# Altium schematic sheet 23_IMU_GPS.SchDoc (part 1 of 2)
size A3; SheetNumber: 24; SheetTotal: 24
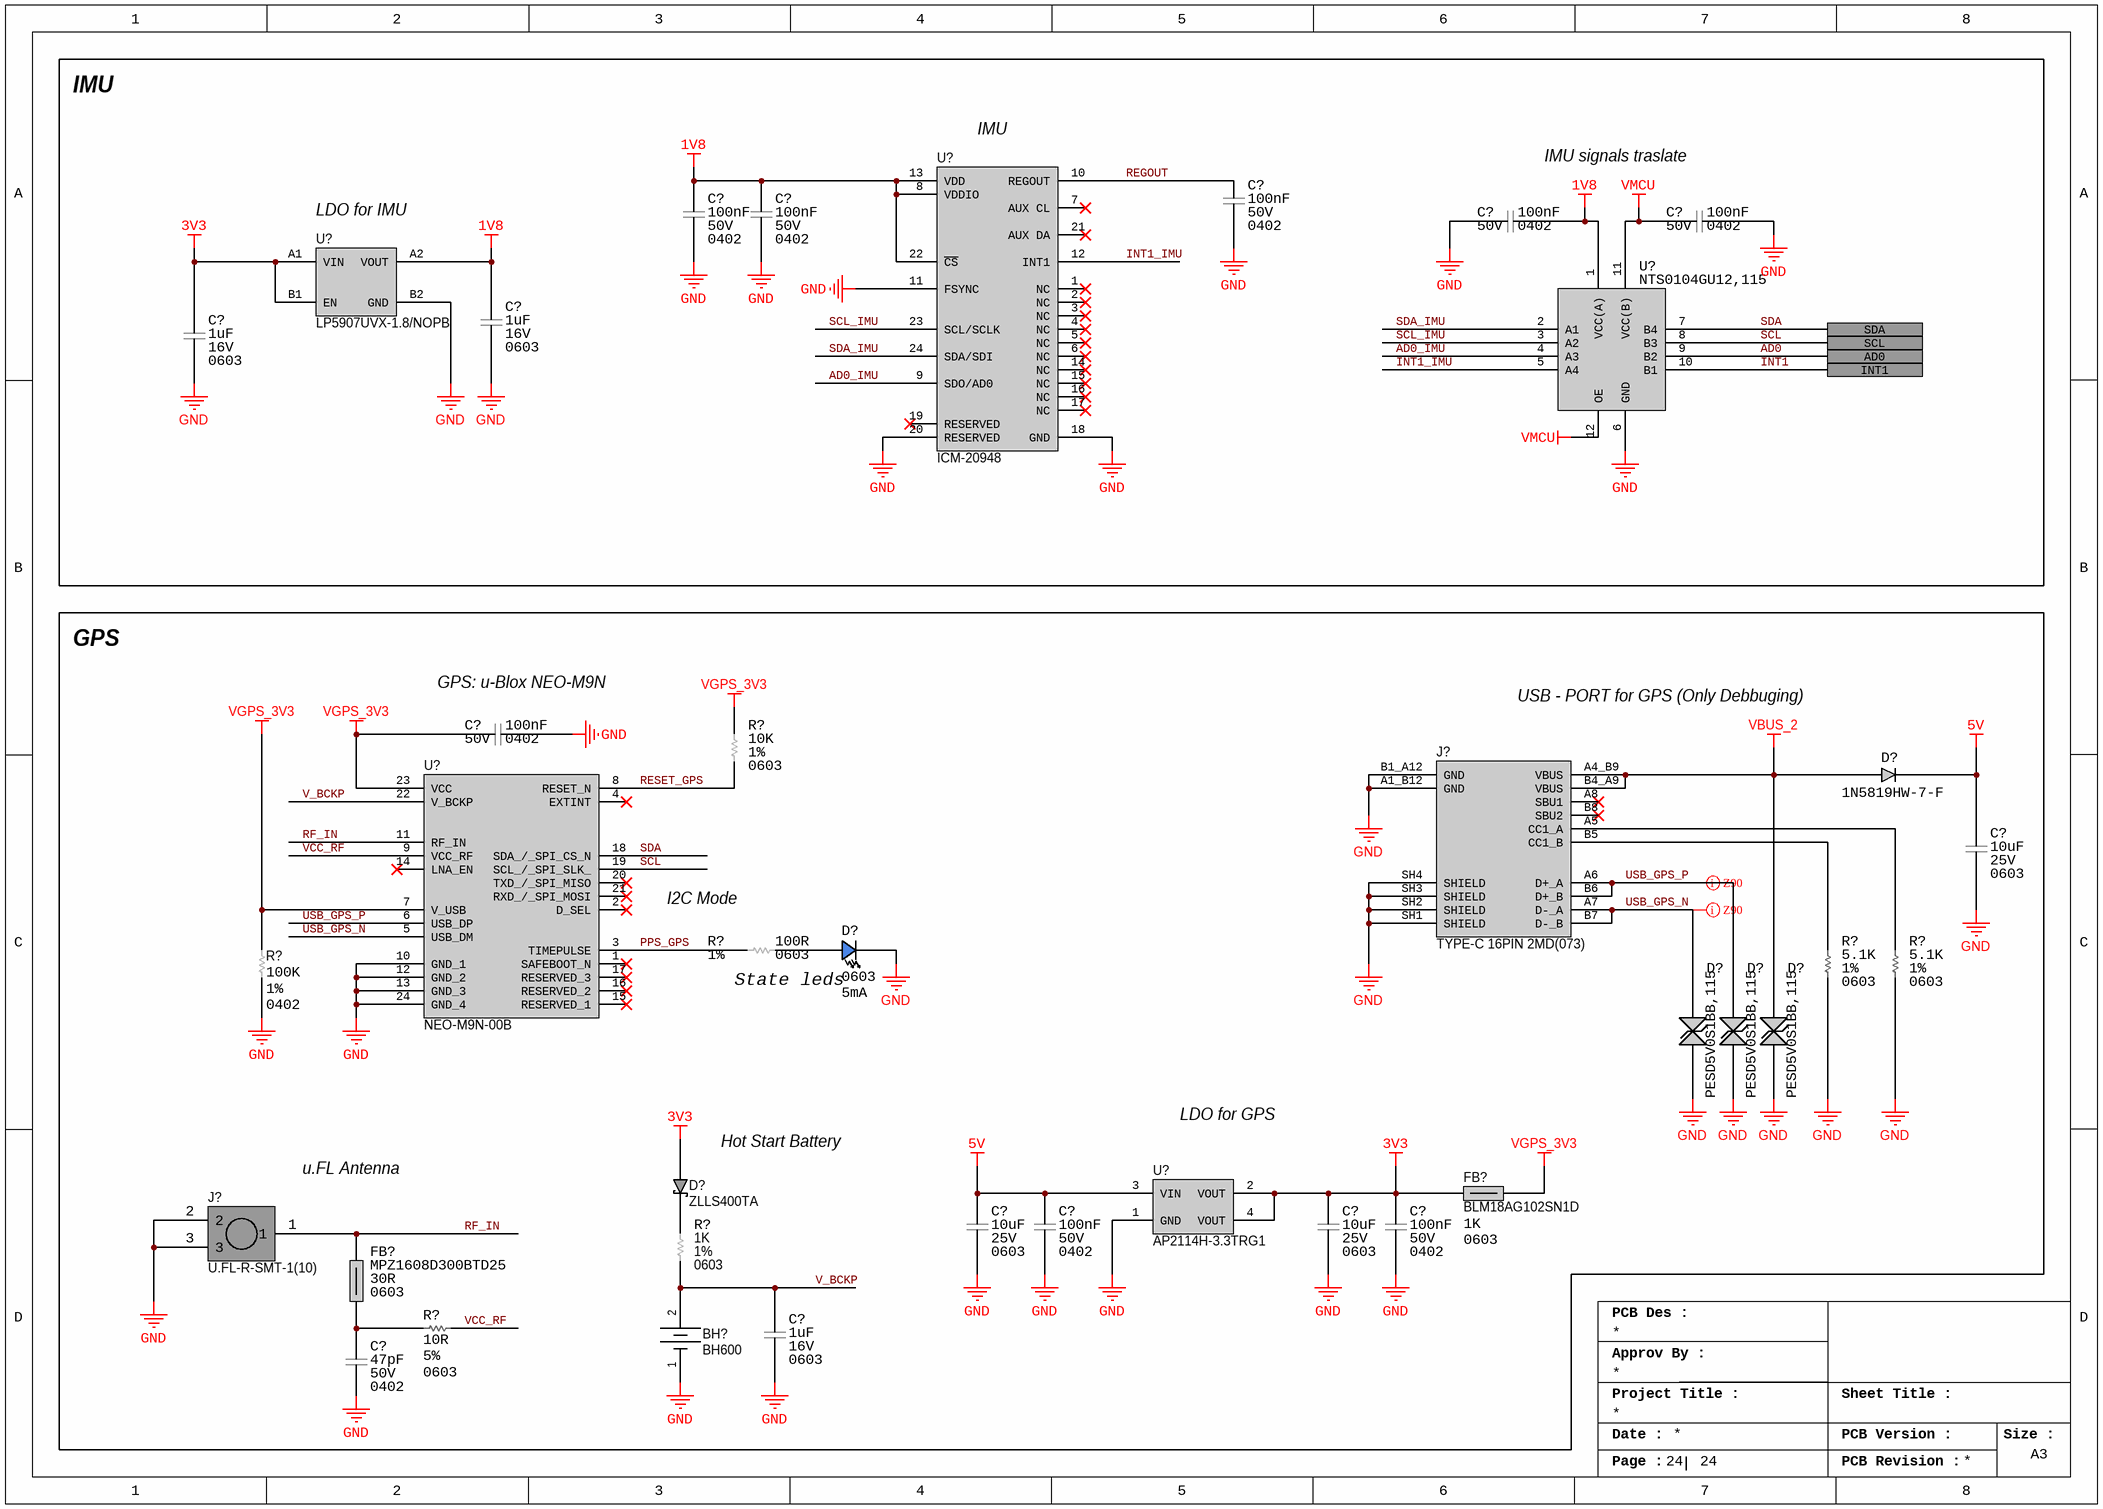
[diagram p0: 23_IMU_GPS.SchDoc]

## Parts
(Parts that share a designator on the sheet are numbered #1, #2 ... from top to bottom, then left to right.)
BH?  BH600  [MECH_BATTERY_HOLDER_BH600]
C?#1  Voltage Rating: 50V  Capacitance: 100nF  Case/Package: 0402  [CAP_0402_CAPC1005X05N]  (hidden comment: GRM155R71H104KE14D)
C?#2  Voltage Rating: 50V  Capacitance: 100nF  Case/Package: 0402  [CAP_0402_CAPC1005X05N]  (hidden comment: GRM155R71H104KE14D)
C?#3  Voltage Rating: 50V  Capacitance: 100nF  Case/Package: 0402  [CAP_0402_CAPC1005X05N]  (hidden comment: GRM155R71H104KE14D)
C?#4  Voltage Rating: 50V  Capacitance: 100nF  Case/Package: 0402  [CAP_0402_CAPC1005X05N]  (hidden comment: GRM155R71H104KE14D)
C?#5  Voltage Rating: 50V  Capacitance: 100nF  Case/Package: 0402  [CAP_0402_CAPC1005X05N]  (hidden comment: GRM155R71H104KE14D)
C?#6  Voltage Rating: 16V  Capacitance: 1uF  Case/Package: 0603  [CAP_0603_CAPC1608X08N]  (hidden comment: CL10A105KO8NNNC)
C?#7  Voltage Rating: 16V  Capacitance: 1uF  Case/Package: 0603  [CAP_0603_CAPC1608X08N]  (hidden comment: CL10A105KO8NNNC)
C?#8  Voltage Rating: 50V  Capacitance: 100nF  Case/Package: 0402  [CAP_0402_CAPC1005X05N]  (hidden comment: GRM155R71H104KE14D)
C?#9  Case/Package: 0603  Capacitance: 10uF  Voltage Rating: 25V  [CAP_0603_CAPC1608X08N]  (hidden comment: GRM188R61E106MA73D)
C?#10  Case/Package: 0603  Capacitance: 10uF  Voltage Rating: 25V  [CAP_0603_CAPC1608X08N]  (hidden comment: GRM188R61E106MA73D)
C?#11  Voltage Rating: 50V  Capacitance: 100nF  Case/Package: 0402  [CAP_0402_CAPC1005X05N]  (hidden comment: GRM155R71H104KE14D)
C?#12  Case/Package: 0603  Capacitance: 10uF  Voltage Rating: 25V  [CAP_0603_CAPC1608X08N]  (hidden comment: GRM188R61E106MA73D)
C?#13  Voltage Rating: 50V  Capacitance: 100nF  Case/Package: 0402  [CAP_0402_CAPC1005X05N]  (hidden comment: GRM155R71H104KE14D)
C?#14  Voltage Rating: 16V  Capacitance: 1uF  Case/Package: 0603  [CAP_0603_CAPC1608X08N]  (hidden comment: CL10A105KO8NNNC)
C?#15  Voltage Rating: 50V  Case/Package: 0402  Capacitance: 47pF  [CAP_0402_CAPC1005X05N]  (hidden comment: GCQ1555C1H470JB01D)
D?#1  1N5819HW-7-F  [DIO_SOD3716X145N]
D?#2  Case Code (Imperial): 0603  Test Current: 5mA  [LED_0603-BLUE-0.75mm]  (hidden comment: LTST-C193TBKT-5A)
D?#3  PESD5V0S1BB,115  [DIO_TVS_SODFL1608X65N]
D?#4  PESD5V0S1BB,115  [DIO_TVS_SODFL1608X65N]
D?#5  PESD5V0S1BB,115  [DIO_TVS_SODFL1608X65N]
D?#6  ZLLS400TA  [DIO_SOD2512X113N]
FB?#1  BLM18AG102SN1D  Impedance: 1K  Case/Package: 0603  [IND_0603_INDC1608X08N]
FB?#2  MPZ1608D300BTD25  Impedance: 30R  Case/Package: 0603  [IND_0603_INDC1608X08N]
J?#1  TYPE-C 16PIN 2MD(073)  [CONN_USB_C_16P]
J?#2  U.FL-R-SMT-1(10)  [CONN_UFL_U.FL-R-SMT-1(10)]
R?#1  Resistance: 10K  Tolerance: 1%  Case/Package: 0603  [RES_0603_RESC1608X04N]  (hidden comment: AC0603FR-1010KL)
R?#2  Case Code (Imperial): 0603  Tolerance: 1%  Resistance: 100R  [CAP_0603_CAPC1608X08N]  (hidden comment: ERJ3EKF1000V)
R?#3  Resistance: 100K  Tolerance: 1%  Case/Package: 0402  [RES_0402_RESC1005X04N]  (hidden comment: RC0402FR-07100KL)
R?#4  Tolerance: 1%  Resistance: 5.1K  Case/Package: 0603  [RES_0603_RESC1608X04N]  (hidden comment: RC0603FR-075K1L)
R?#5  Tolerance: 1%  Resistance: 5.1K  Case/Package: 0603  [RES_0603_RESC1608X04N]  (hidden comment: RC0603FR-075K1L)
R?#6  Resistance: 1K  Tolerance: 1%  Case/Package: 0603  [RES_0603_RESC1608X04N]  (hidden comment: AC0603FR-101KL)
R?#7  Resistance: 10R  Tolerance: 5%  Case/Package: 0603  [RES_0603_RESC1608X04N]  (hidden comment: RC0603JR-0710RL)
U?#1  LP5907UVX-1.8/NOPB  [IC_REG_LDO_BGA4C35P2X2_71X71X40]
U?#2  NTS0104GU12,115  [IC_LEVEL_TRASLATOR_XQFN12_0P4_1P8X2P1]
U?#3  ICM-20948  [IC_IMU_TDK_InvenSense_0_IPC_A]
U?#4  NEO-M9N-00B  [IC_MODULE_UBLOX_NEOM9N00B]
U?#5  AP2114H-3.3TRG1  [IC_REG_SOT230P700X180-4N]

## Blocks framed on the sheet
IMU: C?#1-C?#7 U?#1-U?#3
GPS: BH? C?#8-C?#15 D?#1-D?#6 FB?#1 FB?#2 J?#1 J?#2 R?#1-R?#7 U?#4 U?#5

## Ports
AD0, INT1, SCL, SDA

## Nets
1V8: C?#2.2 C?#4.2 C?#5.2 C?#6.2 U?#1.A2(VOUT) U?#2.1(VCC(A)) U?#3.8(VDDIO) U?#3.13(VDD) U?#3.22(~{CS})
3V3: C?#7.2 C?#12.2 C?#13.2 D?#6.2(A) FB?#1.1 U?#1.A1(VIN) U?#1.B1(EN) U?#5.2(VOUT) U?#5.4(VOUT)
5V: C?#9.2 C?#10.2 C?#11.2 D?#1.1(K) U?#5.3(VIN)
GND: BH?.1(-) C?#1.1 C?#2.1 C?#3.2 C?#4.1 C?#5.1 C?#6.1 C?#7.1 C?#8.2 C?#9.1 C?#10.1 C?#11.1 C?#12.1 C?#13.1 C?#14.1 C?#15.1 D?#2.1(C) D?#3.1(K1) D?#4.1(K1) D?#5.1(K1) J?#1.A1_B12(GND) J?#1.B1_A12(GND) J?#1.SH1(SHIELD) J?#1.SH2(SHIELD) J?#1.SH3(SHIELD) J?#1.SH4(SHIELD) J?#2.2 J?#2.3 R?#3.1 R?#4.1 R?#5.1 U?#1.B2(GND) U?#2.6(GND) U?#3.11(FSYNC) U?#3.18(GND) U?#3.20(RESERVED) U?#4.10(GND_1) U?#4.12(GND_2) U?#4.13(GND_3) U?#4.24(GND_4) U?#5.1(GND)
VBUS_2: D?#1.2(A) D?#5.2(K2) J?#1.A4_B9(VBUS) J?#1.B4_A9(VBUS)
VGPS_3V3: C?#8.1 FB?#1.2 R?#1.2 R?#3.2 U?#4.7(V_USB) U?#4.23(VCC)
VMCU: C?#3.1 U?#2.11(VCC(B)) U?#2.12(OE)
AD0: U?#2.9(B2) ; port AD0
AD0_IMU: U?#2.4(A3) U?#3.9(SDO/AD0)
INT1: U?#2.10(B1) ; port INT1
INT1_IMU: U?#2.5(A4) U?#3.12(INT1)
PPS_GPS: R?#2.1 U?#4.3(TIMEPULSE)
REGOUT: C?#1.2 U?#3.10(REGOUT)
RESET_GPS: R?#1.1 U?#4.8(RESET_N)
RF_IN: FB?#2.2 J?#2.1 U?#4.11(RF_IN)
SCL: U?#2.8(B3) U?#4.19(SCL_/_SPI_SLK_) ; port SCL
SCL_IMU: U?#2.3(A2) U?#3.23(SCL/SCLK)
SDA: U?#2.7(B4) U?#4.18(SDA_/_SPI_CS_N) ; port SDA
SDA_IMU: U?#2.2(A1) U?#3.24(SDA/SDI)
USB_GPS_N: D?#3.2(K2) J?#1.A7(D-_A) J?#1.B7(D-_B) U?#4.5(USB_DM)
USB_GPS_P: D?#4.2(K2) J?#1.A6(D+_A) J?#1.B6(D+_B) U?#4.6(USB_DP)
V_BCKP: BH?.2(+) C?#14.2 R?#6.1 U?#4.22(V_BCKP)
VCC_RF: R?#7.2 U?#4.9(VCC_RF)
NetC?#15_2: C?#15.2 FB?#2.1 R?#7.1
NetD?#2_2: D?#2.2(A) R?#2.2
NetD?#6_1: D?#6.1(K) R?#6.2
NetJ?#1_A5: J?#1.A5(CC1_A) R?#5.2
NetJ?#1_B5: J?#1.B5(CC1_B) R?#4.2

Not connected (* = marked no-connect by the designer): J?#1 A8(SBU1)* B8(SBU2)*; U?#3 1(NC)* 2(NC)* 3(NC)* 4(NC)* 5(NC)* 6(NC)* 7(AUX_CL)* 14(NC)* 15(NC)* 16(NC)* 17(NC)* 19(RESERVED)* 21(AUX_DA)*; U?#4 1(SAFEBOOT_N)* 2(D_SEL)* 4(EXTINT)* 14(LNA_EN)* 15(RESERVED_1)* 16(RESERVED_2)* 17(RESERVED_3)* 20(TXD_/_SPI_MISO)* 21(RXD_/_SPI_MOSI)*

## Layout directives
differential pair; differential pair class Z90; net class Z90: USB_GPS_N, USB_GPS_P

## Notes on the sheet
- (near U?#3) IMU
- IMU signals traslate
- (near U?#1) LDO for IMU
- (near C?#8) GPS: u-Blox NEO-M9N
- USB - PORT for GPS (Only Debbuging)
- (near R?#2) I2C Mode
- State leds
- LDO for GPS
- (near J?#2) u.FL Antenna
- (near D?#6) Hot Start Battery
- PCB Des :
- Approv By :
- Project Title :
- Sheet Title :
- Date :
- PCB Version :
- Size :
- A3
- Page :
- PCB Revision :